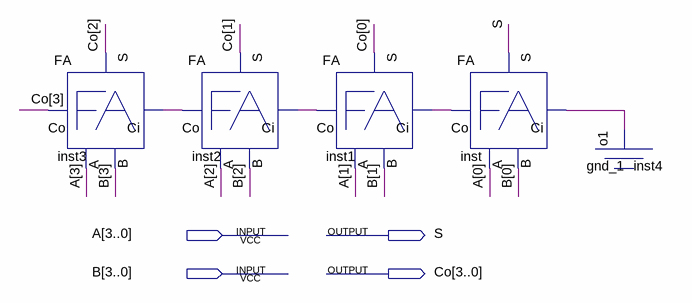
[diagram p0: schematic sheet]
// Quartus schematic FA4.bdf as structural Verilog: 5 symbols, 4 pins
module FA4 (
  input  [3:0] A,
  input  [3:0] B,
  output S,
  output [3:0] Co
);

  wire inst1_co, inst2_co, inst4_o1, inst_co;

  FA inst3 (.A(A[3]), .B(B[3]), .Ci(inst2_co), .S(Co[2]), .Co(Co[3]));
  FA inst2 (.A(A[2]), .B(B[2]), .Ci(inst1_co), .S(Co[1]), .Co(inst2_co));
  FA inst1 (.A(A[1]), .B(B[1]), .Ci(inst_co), .S(Co[0]), .Co(inst1_co));
  FA inst (.A(A[0]), .B(B[0]), .Ci(inst4_o1), .S(S), .Co(inst_co));
  gnd_1 inst4 (.o1(inst4_o1));
endmodule
